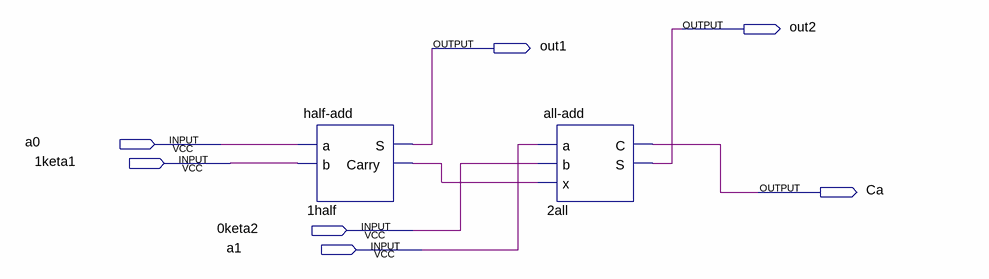
[diagram p0: schematic sheet]
// Quartus schematic 2add.bdf as structural Verilog: 2 symbols, 7 pins
module \2add  (
  input  a0,
  input  \1keta1 ,
  input  \0keta2 ,
  input  a1,
  output out2,
  output out1,
  output Ca
);

  wire n1half_carry;

  \half-add  u_1half (.a(a0), .b(\1keta1 ), .S(out1), .Carry(n1half_carry));
  \all-add  u_2all (.a(a1), .b(\0keta2 ), .x(n1half_carry), .C(Ca), .S(out2));
endmodule
